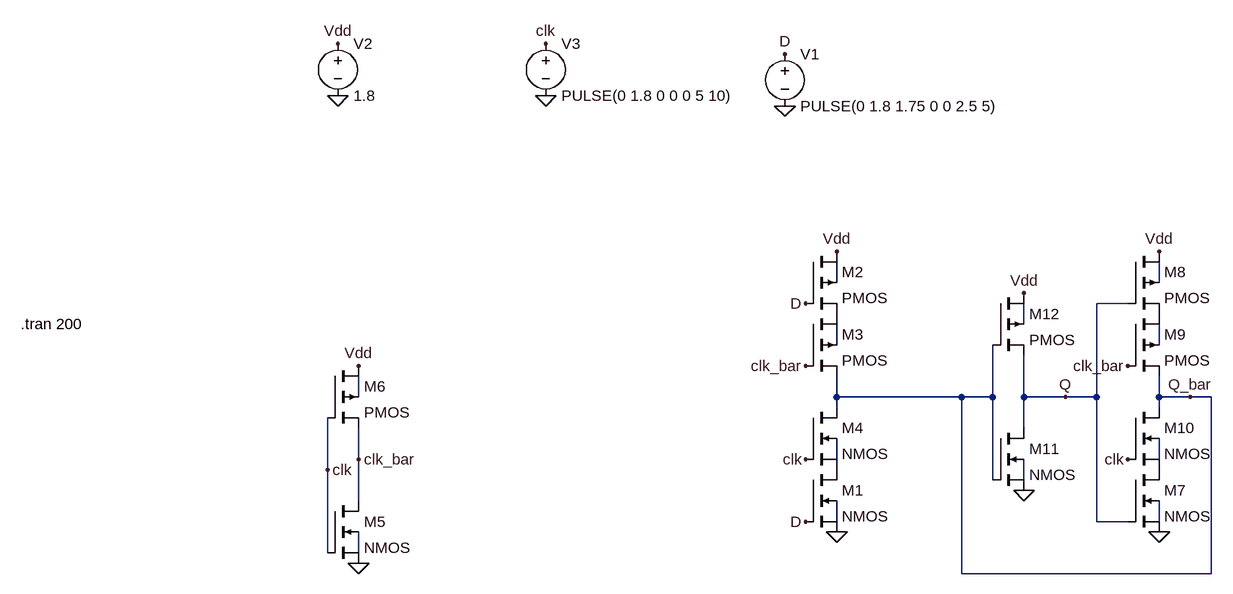
[diagram p0: schematic D_FF_1.asc]
D_FF_1.asc, the LTspice schematic file:
Version 4
SHEET 1 1080 788
WIRE 448 336 448 304
WIRE 944 336 944 304
WIRE 896 368 848 368
WIRE 736 400 736 368
WIRE 448 432 448 400
WIRE 944 432 944 400
WIRE -288 512 -288 480
WIRE 448 512 448 480
WIRE 640 512 448 512
WIRE 688 512 688 432
WIRE 688 512 640 512
WIRE 736 512 736 448
WIRE 800 512 736 512
WIRE 848 512 848 368
WIRE 848 512 800 512
WIRE 944 512 944 480
WIRE 992 512 944 512
WIRE 1024 512 992 512
WIRE 448 528 448 512
WIRE 944 528 944 512
WIRE 736 560 736 512
WIRE -288 608 -288 560
WIRE 448 608 448 576
WIRE 944 608 944 576
WIRE -336 624 -336 544
WIRE 688 640 688 512
WIRE 736 640 736 608
WIRE -288 672 -288 608
WIRE 448 704 448 672
WIRE 448 704 432 704
WIRE 848 704 848 512
WIRE 896 704 848 704
WIRE 944 704 944 672
WIRE 944 704 928 704
WIRE -336 752 -336 624
WIRE -288 752 -288 720
WIRE 640 784 640 512
WIRE 1024 784 1024 512
WIRE 1024 784 640 784
FLAG 448 288 Vdd
FLAG 0 -32 clk
FLAG 0 48 0
FLAG -320 -32 Vdd
FLAG -320 48 0
FLAG 368 -16 D
FLAG 368 64 0
FLAG 448 720 0
FLAG -288 768 0
FLAG -288 464 Vdd
FLAG -336 624 clk
FLAG -288 608 clk_bar
FLAG 944 288 Vdd
FLAG 944 720 0
FLAG 736 656 0
FLAG 736 352 Vdd
FLAG 400 608 clk
FLAG 400 464 clk_bar
FLAG 400 368 D
FLAG 400 704 D
FLAG 896 464 clk_bar
FLAG 896 608 clk
FLAG 992 512 Q_bar
FLAG 800 512 Q
SYMBOL nmos4 400 624 R0
SYMATTR InstName M1
SYMATTR Value2 l=0.13u w=0.13u
SYMBOL pmos4 400 288 R0
SYMATTR InstName M2
SYMATTR Value2 l=0.13u w=0.13u
SYMBOL voltage 0 -48 R0
WINDOW 123 0 0 Left 0
WINDOW 39 0 0 Left 0
SYMATTR InstName V3
SYMATTR Value PULSE(0 1.8 0 0 0 5 10)
SYMBOL voltage -320 -48 R0
WINDOW 123 0 0 Left 0
WINDOW 39 0 0 Left 0
SYMATTR InstName V2
SYMATTR Value 1.8
SYMBOL voltage 368 -32 R0
WINDOW 123 0 0 Left 0
WINDOW 39 0 0 Left 0
SYMATTR InstName V1
SYMATTR Value PULSE(0 1.8 1.75 0 0 2.5 5)
SYMBOL pmos4 400 384 R0
SYMATTR InstName M3
SYMATTR Value2 l=0.13u w=0.13u
SYMBOL nmos4 400 528 R0
SYMATTR InstName M4
SYMATTR Value2 l=0.13u w=0.13u
SYMBOL nmos4 -336 672 R0
SYMATTR InstName M5
SYMATTR Value2 l=0.13u w=0.13u
SYMBOL pmos4 -336 464 R0
SYMATTR InstName M6
SYMATTR Value2 l=0.13u w=0.13u
SYMBOL nmos4 896 624 R0
SYMATTR InstName M7
SYMATTR Value2 l=0.13u w=0.13u
SYMBOL pmos4 896 288 R0
SYMATTR InstName M8
SYMATTR Value2 l=0.13u w=0.13u
SYMBOL pmos4 896 384 R0
SYMATTR InstName M9
SYMATTR Value2 l=0.13u w=0.13u
SYMBOL nmos4 896 528 R0
SYMATTR InstName M10
SYMATTR Value2 l=0.13u w=0.13u
SYMBOL nmos4 688 560 R0
SYMATTR InstName M11
SYMATTR Value2 l=0.13u w=0.13u
SYMBOL pmos4 688 352 R0
SYMATTR InstName M12
SYMATTR Value2 l=0.13u w=0.13u
TEXT -808 400 Left 2 !.tran 200

The netlist it stands for:
* D_FF_1.asc
M1 P001 D 0 N010 NMOS l=0.13u w=0.13u
M2 Vdd D P002 N001 PMOS l=0.13u w=0.13u
V3 clk 0 PULSE(0 1.8 0 0 0 5 10)
V2 Vdd 0 1.8
V1 D 0 PULSE(0 1.8 1.75 0 0 2.5 5)
M3 P002 clk_bar Q_bar N004 PMOS l=0.13u w=0.13u
M4 Q_bar clk P001 N007 NMOS l=0.13u w=0.13u
M5 clk_bar clk 0 N012 NMOS l=0.13u w=0.13u
M6 Vdd clk clk_bar N006 PMOS l=0.13u w=0.13u
M7 P003 Q 0 N011 NMOS l=0.13u w=0.13u
M8 Vdd Q P004 N002 PMOS l=0.13u w=0.13u
M9 P004 clk_bar Q_bar N005 PMOS l=0.13u w=0.13u
M10 Q_bar clk P003 N008 NMOS l=0.13u w=0.13u
M11 Q Q_bar 0 N009 NMOS l=0.13u w=0.13u
M12 Vdd Q_bar Q N003 PMOS l=0.13u w=0.13u
.model NMOS NMOS
.model PMOS PMOS
.lib standard.mos
.tran 200
.backanno
.end